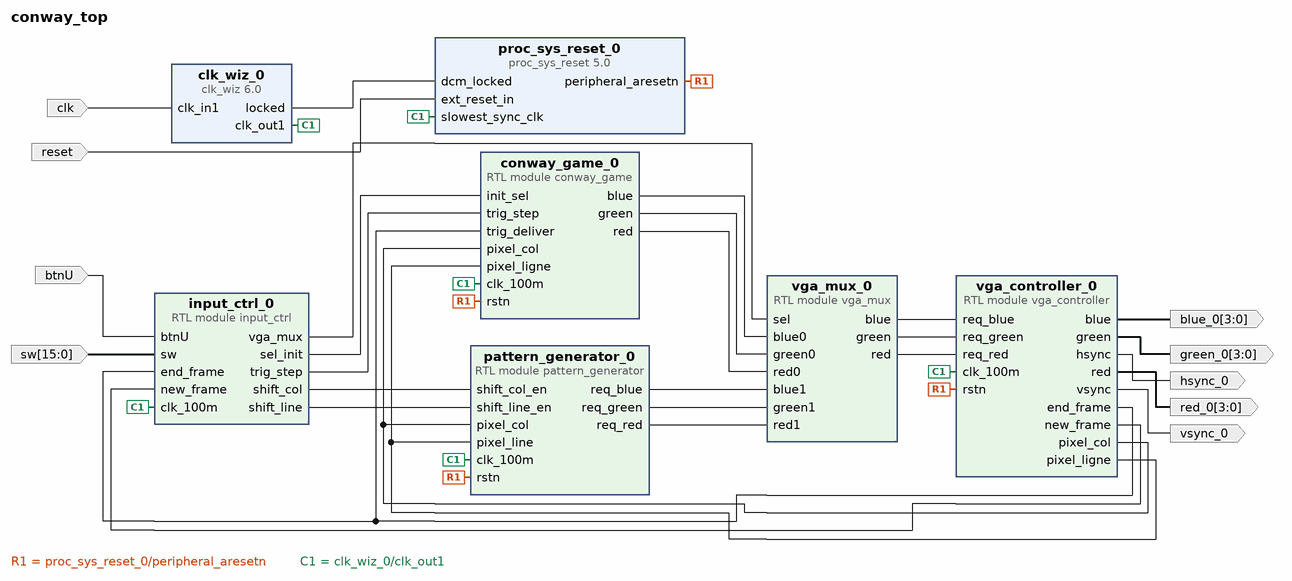
[diagram p0: block diagram of the top level]
# Vivado block design conway_top, xc7a35tcpg236-1, Vivado 2024.2
create_bd_design conway_top

create_bd_port -dir I -type clk clk
create_bd_port -dir I -type rst reset
set_property -dict {CONFIG.POLARITY ACTIVE_HIGH} [get_bd_ports reset]
create_bd_port -dir O vsync_0
create_bd_port -dir O -from 3 -to 0 blue_0
create_bd_port -dir O hsync_0
create_bd_port -dir O -from 3 -to 0 green_0
create_bd_port -dir O -from 3 -to 0 red_0
create_bd_port -dir I btnU
create_bd_port -dir I -from 15 -to 0 sw

create_bd_cell -type module -reference vga_controller vga_controller_0
create_bd_cell -type module -reference pattern_generator pattern_generator_0
create_bd_cell -type ip -vlnv xilinx.com:ip:clk_wiz:6.0 clk_wiz_0
set_property -dict {CONFIG.USE_LOCKED true CONFIG.USE_RESET false} [get_bd_cells clk_wiz_0]
create_bd_cell -type ip -vlnv xilinx.com:ip:proc_sys_reset:5.0 proc_sys_reset_0
create_bd_cell -type module -reference conway_game conway_game_0
create_bd_cell -type module -reference vga_mux vga_mux_0
create_bd_cell -type module -reference input_ctrl input_ctrl_0

# ---- connections ----

connect_bd_net [get_bd_pins proc_sys_reset_0/peripheral_aresetn] \
  [get_bd_pins pattern_generator_0/rstn] [get_bd_pins vga_controller_0/rstn] [get_bd_pins conway_game_0/rstn]
connect_bd_net [get_bd_pins clk_wiz_0/clk_out1] \
  [get_bd_pins proc_sys_reset_0/slowest_sync_clk] [get_bd_pins pattern_generator_0/clk_100m] \
  [get_bd_pins vga_controller_0/clk_100m] [get_bd_pins conway_game_0/clk_100m] [get_bd_pins input_ctrl_0/clk_100m]
connect_bd_net -net btnU_0_1 [get_bd_ports btnU] [get_bd_pins input_ctrl_0/btnU]
connect_bd_net -net clk_in1_0_1 [get_bd_ports clk] [get_bd_pins clk_wiz_0/clk_in1]
connect_bd_net [get_bd_pins clk_wiz_0/locked] [get_bd_pins proc_sys_reset_0/dcm_locked]
connect_bd_net [get_bd_pins conway_game_0/blue] [get_bd_pins vga_mux_0/blue0]
connect_bd_net [get_bd_pins conway_game_0/green] [get_bd_pins vga_mux_0/green0]
connect_bd_net [get_bd_pins conway_game_0/red] [get_bd_pins vga_mux_0/red0]
connect_bd_net -net ext_reset_in_0_1 [get_bd_ports reset] [get_bd_pins proc_sys_reset_0/ext_reset_in]
connect_bd_net [get_bd_pins input_ctrl_0/sel_init] [get_bd_pins conway_game_0/init_sel]
connect_bd_net [get_bd_pins input_ctrl_0/shift_col] [get_bd_pins pattern_generator_0/shift_col_en]
connect_bd_net [get_bd_pins input_ctrl_0/shift_line] [get_bd_pins pattern_generator_0/shift_line_en]
connect_bd_net [get_bd_pins input_ctrl_0/trig_step] [get_bd_pins conway_game_0/trig_step]
connect_bd_net [get_bd_pins input_ctrl_0/vga_mux] [get_bd_pins vga_mux_0/sel]
connect_bd_net [get_bd_pins pattern_generator_0/req_blue] [get_bd_pins vga_mux_0/blue1]
connect_bd_net [get_bd_pins pattern_generator_0/req_green] [get_bd_pins vga_mux_0/green1]
connect_bd_net [get_bd_pins pattern_generator_0/req_red] [get_bd_pins vga_mux_0/red1]
connect_bd_net -net sw_0_1 [get_bd_ports sw] [get_bd_pins input_ctrl_0/sw]
connect_bd_net [get_bd_pins vga_controller_0/blue] [get_bd_ports blue_0]
connect_bd_net [get_bd_pins vga_controller_0/end_frame] [get_bd_pins conway_game_0/trig_deliver] [get_bd_pins input_ctrl_0/end_frame]
connect_bd_net [get_bd_pins vga_controller_0/green] [get_bd_ports green_0]
connect_bd_net [get_bd_pins vga_controller_0/hsync] [get_bd_ports hsync_0]
connect_bd_net [get_bd_pins vga_controller_0/new_frame] [get_bd_pins input_ctrl_0/new_frame]
connect_bd_net [get_bd_pins vga_controller_0/pixel_col] [get_bd_pins pattern_generator_0/pixel_col] [get_bd_pins conway_game_0/pixel_col]
connect_bd_net [get_bd_pins vga_controller_0/pixel_ligne] [get_bd_pins pattern_generator_0/pixel_line] [get_bd_pins conway_game_0/pixel_ligne]
connect_bd_net [get_bd_pins vga_controller_0/red] [get_bd_ports red_0]
connect_bd_net [get_bd_pins vga_controller_0/vsync] [get_bd_ports vsync_0]
connect_bd_net [get_bd_pins vga_mux_0/blue] [get_bd_pins vga_controller_0/req_blue]
connect_bd_net [get_bd_pins vga_mux_0/green] [get_bd_pins vga_controller_0/req_green]
connect_bd_net [get_bd_pins vga_mux_0/red] [get_bd_pins vga_controller_0/req_red]

validate_bd_design
save_bd_design
